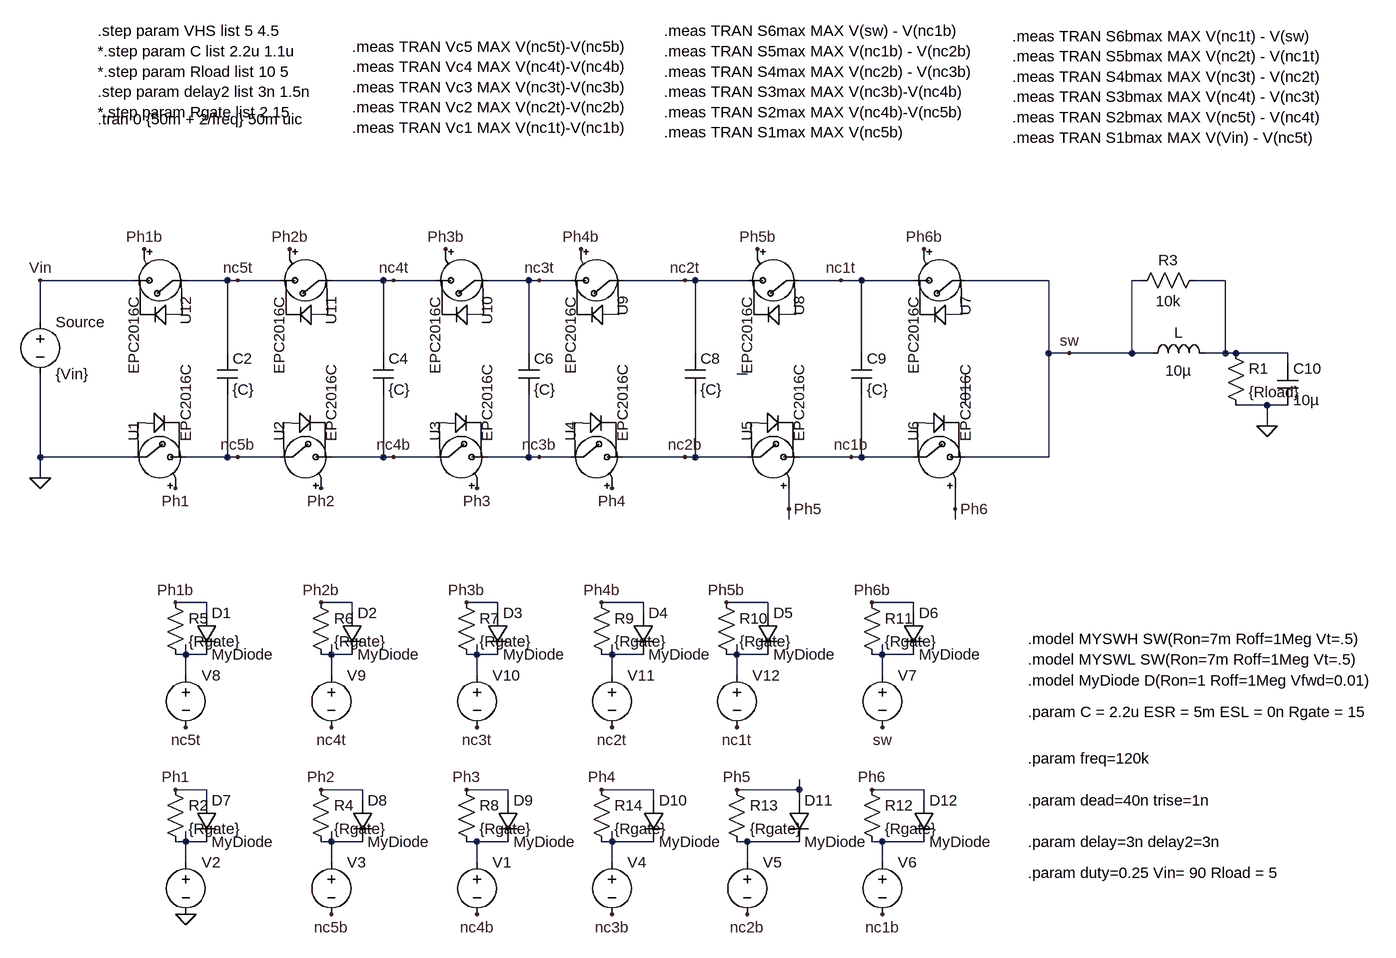
[diagram p0: schematic 7level_delay_EPC_Rgate15.asc]
7level_delay_EPC_Rgate15.asc, the LTspice schematic file:
Version 4
SHEET 1 1904 1428
WIRE -1152 80 -1296 80
WIRE -1008 80 -1072 80
WIRE -992 80 -1008 80
WIRE -928 80 -992 80
WIRE -768 80 -848 80
WIRE -752 80 -768 80
WIRE -688 80 -752 80
WIRE -544 80 -608 80
WIRE -528 80 -544 80
WIRE -480 80 -528 80
WIRE -304 80 -400 80
WIRE -288 80 -304 80
WIRE -208 80 -288 80
WIRE -64 80 -128 80
WIRE -32 80 -64 80
WIRE 48 80 -32 80
WIRE 256 80 128 80
WIRE 400 80 384 80
WIRE 528 80 480 80
WIRE -1296 144 -1296 80
WIRE -1008 192 -1008 80
WIRE -768 192 -768 80
WIRE -544 192 -544 80
WIRE -288 192 -288 80
WIRE -32 192 -32 80
WIRE 256 192 256 80
WIRE 288 192 256 192
WIRE 384 192 384 80
WIRE 384 192 288 192
WIRE 416 192 384 192
WIRE 528 192 528 80
WIRE 528 192 496 192
WIRE 544 192 528 192
WIRE 624 192 544 192
WIRE 624 208 624 192
WIRE -208 224 -224 224
WIRE 128 272 128 224
WIRE 592 272 544 272
WIRE 624 272 592 272
WIRE 592 304 592 272
WIRE -1296 352 -1296 224
WIRE -1152 352 -1296 352
WIRE -1008 352 -1008 256
WIRE -1008 352 -1072 352
WIRE -992 352 -1008 352
WIRE -928 352 -992 352
WIRE -768 352 -768 256
WIRE -768 352 -848 352
WIRE -752 352 -768 352
WIRE -688 352 -752 352
WIRE -544 352 -544 256
WIRE -544 352 -608 352
WIRE -528 352 -544 352
WIRE -480 352 -528 352
WIRE -304 352 -400 352
WIRE -288 352 -288 256
WIRE -288 352 -304 352
WIRE -208 352 -288 352
WIRE -48 352 -128 352
WIRE -32 352 -32 256
WIRE -32 352 -48 352
WIRE 48 352 -32 352
WIRE 256 352 256 192
WIRE 256 352 128 352
WIRE -1296 384 -1296 352
WIRE -144 432 -144 400
WIRE 112 432 112 400
WIRE -144 448 -144 432
WIRE 112 448 112 432
WIRE -1040 576 -1088 576
WIRE -816 576 -864 576
WIRE -592 576 -640 576
WIRE -368 576 -432 576
WIRE -176 576 -240 576
WIRE 48 576 -16 576
WIRE -1040 592 -1040 576
WIRE -816 592 -816 576
WIRE -592 592 -592 576
WIRE -368 592 -368 576
WIRE -176 592 -176 576
WIRE 48 592 48 576
WIRE -1072 656 -1072 640
WIRE -1072 656 -1088 656
WIRE -1040 656 -1072 656
WIRE -848 656 -848 640
WIRE -848 656 -864 656
WIRE -816 656 -848 656
WIRE -624 656 -624 640
WIRE -624 656 -640 656
WIRE -592 656 -624 656
WIRE -416 656 -416 640
WIRE -416 656 -432 656
WIRE -368 656 -416 656
WIRE -224 656 -224 640
WIRE -224 656 -240 656
WIRE -176 656 -224 656
WIRE 0 656 0 640
WIRE 0 656 -16 656
WIRE 48 656 0 656
WIRE -1072 688 -1072 656
WIRE -848 688 -848 656
WIRE -624 688 -624 656
WIRE -416 688 -416 656
WIRE -224 688 -224 656
WIRE 0 688 0 656
WIRE -1040 864 -1088 864
WIRE -800 864 -864 864
WIRE -576 864 -640 864
WIRE -352 864 -432 864
WIRE -128 864 -128 848
WIRE -128 864 -224 864
WIRE 64 864 -16 864
WIRE -1040 880 -1040 864
WIRE -800 880 -800 864
WIRE -576 880 -576 864
WIRE -352 880 -352 864
WIRE -128 880 -128 864
WIRE 64 880 64 864
WIRE -1072 944 -1072 928
WIRE -1072 944 -1088 944
WIRE -1040 944 -1072 944
WIRE -848 944 -848 928
WIRE -848 944 -864 944
WIRE -800 944 -848 944
WIRE -624 944 -640 944
WIRE -576 944 -624 944
WIRE -416 944 -416 928
WIRE -416 944 -432 944
WIRE -352 944 -416 944
WIRE -208 944 -224 944
WIRE -128 944 -208 944
WIRE 0 944 -16 944
WIRE 64 944 0 944
WIRE -1072 976 -1072 944
WIRE -848 976 -848 944
WIRE -624 976 -624 944
WIRE -416 976 -416 944
WIRE -208 976 -208 944
WIRE 0 976 0 944
FLAG -1072 1056 0
FLAG -1088 864 Ph1
FLAG -1296 80 Vin
FLAG -464 32 Ph4b
FLAG -672 32 Ph3b
FLAG -912 32 Ph2b
FLAG -1136 32 Ph1b
FLAG -864 864 Ph2
FLAG -416 400 Ph4
FLAG -624 400 Ph3
FLAG -1088 400 Ph1
FLAG 592 304 0
FLAG -1296 384 0
FLAG -144 432 Ph5
FLAG 112 432 Ph6
FLAG -192 32 Ph5b
FLAG 64 32 Ph6b
FLAG -640 864 Ph3
FLAG -432 864 Ph4
FLAG -224 864 Ph5
FLAG -16 864 Ph6
FLAG -16 576 Ph6b
FLAG -1088 576 Ph1b
FLAG -864 576 Ph2b
FLAG -640 576 Ph3b
FLAG -432 576 Ph4b
FLAG -240 576 Ph5b
FLAG -992 80 nc5t
FLAG -752 80 nc4t
FLAG -528 80 nc3t
FLAG -304 80 nc2t
FLAG -64 80 nc1t
FLAG -992 352 nc5b
FLAG -752 352 nc4b
FLAG -528 352 nc3b
FLAG -304 352 nc2b
FLAG -48 352 nc1b
FLAG 288 192 sw
FLAG -864 400 Ph2
FLAG -848 1056 nc5b
FLAG -624 1056 nc4b
FLAG -416 1056 nc3b
FLAG -208 1056 nc2b
FLAG 0 1056 nc1b
FLAG 0 768 sw
FLAG -224 768 nc1t
FLAG -416 768 nc2t
FLAG -624 768 nc3t
FLAG -848 768 nc4t
FLAG -1072 768 nc5t
SYMBOL voltage -1072 960 R0
WINDOW 123 0 0 Left 2
WINDOW 39 0 0 Left 2
WINDOW 3 24 96 Invisible 2
SYMATTR Value PULSE(0 5 0 {trise} 1p {1/freq*(1-duty)} {1/freq})
SYMATTR InstName V2
SYMBOL voltage -1296 128 R0
WINDOW 123 0 0 Left 2
WINDOW 39 0 0 Left 2
SYMATTR InstName Source
SYMATTR Value {Vin}
SYMBOL voltage -848 960 R0
WINDOW 123 0 0 Left 2
WINDOW 39 0 0 Left 2
WINDOW 3 24 96 Invisible 2
SYMATTR Value PULSE(0 {VHS} {1/freq/6+delay} {trise} 1p {1/freq*(1-duty)-delay+delay2} {1/freq})
SYMATTR InstName V3
SYMBOL cap -1024 192 R0
SYMATTR InstName C2
SYMATTR Value {C}
SYMATTR SpiceLine Rser={ESR} Lser={ESL}
SYMATTR SpiceLine2 IC={Vin/6*5}
SYMBOL cap -784 192 R0
SYMATTR InstName C4
SYMATTR Value {C}
SYMATTR SpiceLine Rser={ESR} Lser={ESL}
SYMATTR SpiceLine2 IC={Vin/6*4}
SYMBOL cap -560 192 R0
SYMATTR InstName C6
SYMATTR Value {C}
SYMATTR SpiceLine Rser={ESR} Lser={ESL}
SYMATTR SpiceLine2 IC={Vin/6*3}
SYMBOL cap -304 192 R0
SYMATTR InstName C8
SYMATTR Value {C}
SYMATTR SpiceLine Rser={ESR} Lser={ESL}
SYMATTR SpiceLine2 IC={Vin/6*2}
SYMBOL cap -48 192 R0
SYMATTR InstName C9
SYMATTR Value {C}
SYMATTR SpiceLine Rser={ESR} Lser={ESL}
SYMATTR SpiceLine2 IC={Vin/6*1}
SYMBOL ind 400 208 R270
WINDOW 0 32 56 VTop 2
WINDOW 3 5 56 VBottom 2
SYMATTR InstName L
SYMATTR Value 10µ
SYMATTR SpiceLine Rser=25m
SYMATTR SpiceLine2 ic = {Vin*duty/Rload}
SYMBOL res 528 176 R0
SYMATTR InstName R1
SYMATTR Value {Rload}
SYMBOL cap 608 208 R0
SYMATTR InstName C10
SYMATTR Value 10µ
SYMATTR SpiceLine IC={Vin*duty}
SYMATTR SpiceLine2 Rser=1m
SYMBOL voltage -624 960 R0
WINDOW 123 0 0 Left 2
WINDOW 39 0 0 Left 2
WINDOW 3 24 96 Invisible 2
SYMATTR Value PULSE(0 5 {1/freq/3} {trise} 1p {1/freq*(1-duty)} {1/freq})
SYMATTR InstName V1
SYMBOL voltage -416 960 R0
WINDOW 123 0 0 Left 2
WINDOW 39 0 0 Left 2
WINDOW 3 24 96 Invisible 2
SYMATTR Value PULSE(0 {VHS} {1/freq/2+delay} {trise} 1p {1/freq*(1-duty)-delay+delay2} {1/freq})
SYMATTR InstName V4
SYMBOL voltage -208 960 R0
WINDOW 123 0 0 Left 2
WINDOW 39 0 0 Left 2
WINDOW 3 24 96 Invisible 2
SYMATTR Value PULSE(0 5 {1/freq/3*2} {trise} 1p {1/freq*(1-duty)} {1/freq})
SYMATTR InstName V5
SYMBOL voltage 0 960 R0
WINDOW 123 0 0 Left 2
WINDOW 39 0 0 Left 2
WINDOW 3 24 96 Invisible 2
SYMATTR Value PULSE(0 {VHS} {1/freq/6*5+delay} {trise} 1p {1/freq*(1-duty)-delay+delay2} {1/freq})
SYMATTR InstName V6
SYMBOL voltage 0 672 R0
WINDOW 123 0 0 Left 2
WINDOW 39 0 0 Left 2
WINDOW 3 24 96 Invisible 2
SYMATTR Value PULSE(0 5 {1/freq/6*5+1/freq*(1-duty)+dead} {trise} 1p {1/freq*duty-dead*2} {1/freq})
SYMATTR InstName V7
SYMBOL voltage -1072 672 R0
WINDOW 123 0 0 Left 2
WINDOW 39 0 0 Left 2
WINDOW 3 24 96 Invisible 2
SYMATTR Value PULSE(0 {VHS} {1/freq*(1-duty)+dead+delay} {trise} 1p {1/freq*duty-dead*2-delay+delay2} {1/freq})
SYMATTR InstName V8
SYMBOL voltage -848 672 R0
WINDOW 123 0 0 Left 2
WINDOW 39 0 0 Left 2
WINDOW 3 24 96 Invisible 2
SYMATTR Value PULSE(0 5 {1/freq/6+1/freq*(1-duty)+dead} {trise} 1p {1/freq*duty-dead*2} {1/freq})
SYMATTR InstName V9
SYMBOL voltage -624 672 R0
WINDOW 123 0 0 Left 2
WINDOW 39 0 0 Left 2
WINDOW 3 24 44 Invisible 2
SYMATTR Value PULSE(0 {VHS} {1/freq/3+1/freq*(1-duty)+dead+delay} {trise} 1p {1/freq*duty-dead*2-delay+delay2} {1/freq})
SYMATTR InstName V10
SYMBOL voltage -416 672 R0
WINDOW 123 0 0 Left 2
WINDOW 39 0 0 Left 2
WINDOW 3 24 96 Invisible 2
SYMATTR Value PULSE(0 5 {1/freq/2+1/freq*(1-duty)+dead} {trise} 1p {1/freq*duty-dead*2} {1/freq})
SYMATTR InstName V11
SYMBOL voltage -224 672 R0
WINDOW 123 0 0 Left 2
WINDOW 39 0 0 Left 2
WINDOW 3 24 96 Invisible 2
SYMATTR Value PULSE(0 {VHS} {1/freq/3*2+1/freq*(1-duty)+dead+delay} {trise} 1p {1/freq*duty-dead*2-delay+delay2} {1/freq})
SYMATTR InstName V12
SYMBOL res 496 64 R90
WINDOW 0 0 56 VBottom 2
WINDOW 3 32 56 VTop 2
SYMATTR InstName R3
SYMATTR Value 10k
SYMBOL EPCGaN_small -1168 352 R270
SYMATTR InstName U1
SYMATTR Value EPC2016C
SYMBOL EPCGaN_small -944 352 R270
SYMATTR InstName U2
SYMATTR Value EPC2016C
SYMBOL EPCGaN_small -704 352 R270
SYMATTR InstName U3
SYMATTR Value EPC2016C
SYMBOL EPCGaN_small -496 352 R270
SYMATTR InstName U4
SYMATTR Value EPC2016C
SYMBOL EPCGaN_small -224 352 R270
SYMATTR InstName U5
SYMATTR Value EPC2016C
SYMBOL EPCGaN_small 32 352 R270
SYMATTR InstName U6
SYMATTR Value EPC2016C
SYMBOL EPCGaN_small 144 80 R90
SYMATTR InstName U7
SYMATTR Value EPC2016C
SYMBOL EPCGaN_small -112 80 R90
SYMATTR InstName U8
SYMATTR Value EPC2016C
SYMBOL EPCGaN_small -384 80 R90
SYMATTR InstName U9
SYMATTR Value EPC2016C
SYMBOL EPCGaN_small -592 80 R90
SYMATTR InstName U10
SYMATTR Value EPC2016C
SYMBOL EPCGaN_small -832 80 R90
SYMATTR InstName U11
SYMATTR Value EPC2016C
SYMBOL EPCGaN_small -1056 80 R90
SYMATTR InstName U12
SYMATTR Value EPC2016C
SYMBOL res -1104 848 R0
SYMATTR InstName R2
SYMATTR Value {Rgate}
SYMBOL res -880 848 R0
SYMATTR InstName R4
SYMATTR Value {Rgate}
SYMBOL res -1104 560 R0
SYMATTR InstName R5
SYMATTR Value {Rgate}
SYMBOL res -880 560 R0
SYMATTR InstName R6
SYMATTR Value {Rgate}
SYMBOL res -656 560 R0
SYMATTR InstName R7
SYMATTR Value {Rgate}
SYMBOL res -656 848 R0
SYMATTR InstName R8
SYMATTR Value {Rgate}
SYMBOL res -448 560 R0
SYMATTR InstName R9
SYMATTR Value {Rgate}
SYMBOL res -256 560 R0
SYMATTR InstName R10
SYMATTR Value {Rgate}
SYMBOL res -32 560 R0
SYMATTR InstName R11
SYMATTR Value {Rgate}
SYMBOL res -32 848 R0
SYMATTR InstName R12
SYMATTR Value {Rgate}
SYMBOL res -240 848 R0
SYMATTR InstName R13
SYMATTR Value {Rgate}
SYMBOL res -448 848 R0
SYMATTR InstName R14
SYMATTR Value {Rgate}
SYMBOL diode -1056 592 R0
SYMATTR InstName D1
SYMATTR Value MyDiode
SYMBOL diode -832 592 R0
SYMATTR InstName D2
SYMATTR Value MyDiode
SYMBOL diode -608 592 R0
SYMATTR InstName D3
SYMATTR Value MyDiode
SYMBOL diode -384 592 R0
SYMATTR InstName D4
SYMATTR Value MyDiode
SYMBOL diode -192 592 R0
SYMATTR InstName D5
SYMATTR Value MyDiode
SYMBOL diode 32 592 R0
SYMATTR InstName D6
SYMATTR Value MyDiode
SYMBOL diode -1056 880 R0
SYMATTR InstName D7
SYMATTR Value MyDiode
SYMBOL diode -816 880 R0
SYMATTR InstName D8
SYMATTR Value MyDiode
SYMBOL diode -592 880 R0
SYMATTR InstName D9
SYMATTR Value MyDiode
SYMBOL diode -368 880 R0
SYMATTR InstName D10
SYMATTR Value MyDiode
SYMBOL diode -144 880 R0
SYMATTR InstName D11
SYMATTR Value MyDiode
SYMBOL diode 48 880 R0
SYMATTR InstName D12
SYMATTR Value MyDiode
TEXT -1208 -168 Left 2 !.tran 0 {50m + 2/freq} 50m uic
TEXT 224 632 Left 2 !.model MYSWH SW(Ron=7m Roff=1Meg Vt=.5)\n.model MYSWL SW(Ron=7m Roff=1Meg Vt=.5)
TEXT 224 696 Left 2 !.model MyDiode D(Ron=1 Roff=1Meg Vfwd=0.01)
TEXT 224 944 Left 2 !.param delay=3n delay2=3n
TEXT 224 816 Left 2 !.param freq=120k
TEXT 224 992 Left 2 !.param duty=0.25 Vin= 90 Rload = 5
TEXT 224 880 Left 2 !.param dead=40n trise=1n
TEXT 224 744 Left 2 !.param C = 2.2u ESR = 5m ESL = 0n Rgate = 15
TEXT -336 -304 Left 2 !.meas TRAN S6max MAX V(sw) - V(nc1b)\n.meas TRAN S5max MAX V(nc1b) - V(nc2b)\n.meas TRAN S4max MAX V(nc2b) - V(nc3b)\n.meas TRAN S3max MAX V(nc3b)-V(nc4b)\n.meas TRAN S2max MAX V(nc4b)-V(nc5b)\n.meas TRAN S1max MAX V(nc5b)
TEXT -816 -280 Left 2 !.meas TRAN Vc5 MAX V(nc5t)-V(nc5b)\n.meas TRAN Vc4 MAX V(nc4t)-V(nc4b)\n.meas TRAN Vc3 MAX V(nc3t)-V(nc3b)\n.meas TRAN Vc2 MAX V(nc2t)-V(nc2b)\n.meas TRAN Vc1 MAX V(nc1t)-V(nc1b)
TEXT 200 -296 Left 2 !.meas TRAN S6bmax MAX V(nc1t) - V(sw) \n.meas TRAN S5bmax MAX V(nc2t) - V(nc1t) \n.meas TRAN S4bmax MAX V(nc3t) - V(nc2t) \n.meas TRAN S3bmax MAX V(nc4t) - V(nc3t)\n.meas TRAN S2bmax MAX V(nc5t) - V(nc4t)\n.meas TRAN S1bmax MAX V(Vin) - V(nc5t)
TEXT -1208 -304 Left 2 !.step param VHS list 5 4.5\n*.step param C list 2.2u 1.1u\n*.step param Rload list 10 5\n.step param delay2 list 3n 1.5n\n*.step param Rgate list 2 15

The netlist it stands for:
* 7level_delay_EPC_Rgate15.asc
V2 N010 0 PULSE(0 5 0 {trise} 1p {1/freq*(1-duty)} {1/freq})
V§Source Vin 0 {Vin}
V3 N011 nc5b PULSE(0 {VHS} {1/freq/6+delay} {trise} 1p {1/freq*(1-duty)-delay+delay2} {1/freq})
C2 nc5t nc5b {C} Rser={ESR} Lser={ESL} IC={Vin/6*5}
C4 nc4t nc4b {C} Rser={ESR} Lser={ESL} IC={Vin/6*4}
C6 nc3t nc3b {C} Rser={ESR} Lser={ESL} IC={Vin/6*3}
C8 nc2t nc2b {C} Rser={ESR} Lser={ESL} IC={Vin/6*2}
C9 nc1t nc1b {C} Rser={ESR} Lser={ESL} IC={Vin/6*1}
L sw N001 10µ Rser=25m ic = {Vin*duty/Rload}
R1 N001 0 {Rload}
C10 N001 0 10µ IC={Vin*duty} Rser=1m
V1 N012 nc4b PULSE(0 5 {1/freq/3} {trise} 1p {1/freq*(1-duty)} {1/freq})
V4 N013 nc3b PULSE(0 {VHS} {1/freq/2+delay} {trise} 1p {1/freq*(1-duty)-delay+delay2} {1/freq})
V5 N014 nc2b PULSE(0 5 {1/freq/3*2} {trise} 1p {1/freq*(1-duty)} {1/freq})
V6 N015 nc1b PULSE(0 {VHS} {1/freq/6*5+delay} {trise} 1p {1/freq*(1-duty)-delay+delay2} {1/freq})
V7 N009 sw PULSE(0 5 {1/freq/6*5+1/freq*(1-duty)+dead} {trise} 1p {1/freq*duty-dead*2} {1/freq})
V8 N004 nc5t PULSE(0 {VHS} {1/freq*(1-duty)+dead+delay} {trise} 1p {1/freq*duty-dead*2-delay+delay2} {1/freq})
V9 N005 nc4t PULSE(0 5 {1/freq/6+1/freq*(1-duty)+dead} {trise} 1p {1/freq*duty-dead*2} {1/freq})
V10 N006 nc3t PULSE(0 {VHS} {1/freq/3+1/freq*(1-duty)+dead+delay} {trise} 1p {1/freq*duty-dead*2-delay+delay2} {1/freq})
V11 N007 nc2t PULSE(0 5 {1/freq/2+1/freq*(1-duty)+dead} {trise} 1p {1/freq*duty-dead*2} {1/freq})
V12 N008 nc1t PULSE(0 {VHS} {1/freq/3*2+1/freq*(1-duty)+dead+delay} {trise} 1p {1/freq*duty-dead*2-delay+delay2} {1/freq})
R3 N001 sw 10k
XU1 Ph1 nc5b 0 EPC2016C  ; pins gatein drainin N_0
XU2 Ph2 nc4b nc5b EPC2016C  ; pins gatein drainin N_0
XU3 Ph3 nc3b nc4b EPC2016C  ; pins gatein drainin N_0
XU4 Ph4 nc2b nc3b EPC2016C  ; pins gatein drainin N_0
XU5 Ph5 nc1b nc2b EPC2016C  ; pins gatein drainin N_0
XU6 Ph6 sw nc1b EPC2016C  ; pins gatein drainin N_0
XU7 Ph6b nc1t sw EPC2016C  ; pins gatein drainin N_0
XU8 Ph5b nc2t nc1t EPC2016C  ; pins gatein drainin N_0
XU9 Ph4b nc3t nc2t EPC2016C  ; pins gatein drainin N_0
XU10 Ph3b nc4t nc3t EPC2016C  ; pins gatein drainin N_0
XU11 Ph2b nc5t nc4t EPC2016C  ; pins gatein drainin N_0
XU12 Ph1b Vin nc5t EPC2016C  ; pins gatein drainin N_0
R2 Ph1 N010 {Rgate}
R4 Ph2 N011 {Rgate}
R5 Ph1b N004 {Rgate}
R6 Ph2b N005 {Rgate}
R7 Ph3b N006 {Rgate}
R8 Ph3 N012 {Rgate}
R9 Ph4b N007 {Rgate}
R10 Ph5b N008 {Rgate}
R11 Ph6b N009 {Rgate}
R12 Ph6 N015 {Rgate}
R13 Ph5 N014 {Rgate}
R14 Ph4 N013 {Rgate}
D1 Ph1b N004 MyDiode
D2 Ph2b N005 MyDiode
D3 Ph3b N006 MyDiode
D4 Ph4b N007 MyDiode
D5 Ph5b N008 MyDiode
D6 Ph6b N009 MyDiode
D7 Ph1 N010 MyDiode
D8 Ph2 N011 MyDiode
D9 Ph3 N012 MyDiode
D10 Ph4 N013 MyDiode
D11 Ph5 N014 MyDiode
D12 Ph6 N015 MyDiode
.model D D
.lib standard.dio
.tran 0 {50m + 2/freq} 50m uic
.model MYSWH SW(Ron=7m Roff=1Meg Vt=.5)
.model MYSWL SW(Ron=7m Roff=1Meg Vt=.5)
.model MyDiode D(Ron=1 Roff=1Meg Vfwd=0.01)
.param delay=3n delay2=3n
.param freq=120k
.param duty=0.25 Vin= 90 Rload = 5
.param dead=40n trise=1n
.param C = 2.2u ESR = 5m ESL = 0n Rgate = 15
.meas TRAN S6max MAX V(sw) - V(nc1b)
.meas TRAN S5max MAX V(nc1b) - V(nc2b)
.meas TRAN S4max MAX V(nc2b) - V(nc3b)
.meas TRAN S3max MAX V(nc3b)-V(nc4b)
.meas TRAN S2max MAX V(nc4b)-V(nc5b)
.meas TRAN S1max MAX V(nc5b)
.meas TRAN Vc5 MAX V(nc5t)-V(nc5b)
.meas TRAN Vc4 MAX V(nc4t)-V(nc4b)
.meas TRAN Vc3 MAX V(nc3t)-V(nc3b)
.meas TRAN Vc2 MAX V(nc2t)-V(nc2b)
.meas TRAN Vc1 MAX V(nc1t)-V(nc1b)
.meas TRAN S6bmax MAX V(nc1t) - V(sw)
.meas TRAN S5bmax MAX V(nc2t) - V(nc1t)
.meas TRAN S4bmax MAX V(nc3t) - V(nc2t)
.meas TRAN S3bmax MAX V(nc4t) - V(nc3t)
.meas TRAN S2bmax MAX V(nc5t) - V(nc4t)
.meas TRAN S1bmax MAX V(Vin) - V(nc5t)
.step param VHS list 5 4.5
*.step param C list 2.2u 1.1u
*.step param Rload list 10 5
.step param delay2 list 3n 1.5n
*.step param Rgate list 2 15
.lib EPCGanlibrary.lib
.backanno
.end